# EAGLE design rf-bm-s02-breakout (EAGLE 6.5.0)
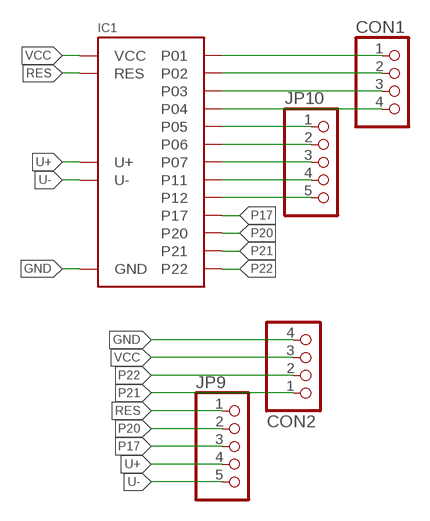
[diagram p0: schematic, sheet 1]

## Parts
CON1  GENERIC-1X4STRAIGHT  [PINHEADER-100MIL-1X4-NOSILK]
CON2  GENERIC-1X4STRAIGHT  [PINHEADER-100MIL-1X4-NOSILK]
IC1  BLUETOOTH-RF-BM-S02  [BLUETOOTH-RF-BM-S02-SMD]
JP9  PINHD-1X5  [1X05]
JP10  PINHD-1X5  [1X05]

## Nets
GND: CON2.4 IC1.P$18(GND)
P01: CON1.1 IC1.P$9(P01)
P02: CON1.2 IC1.P$8(P02)
P03: CON1.3 IC1.P$7(P03)
P04: CON1.4 IC1.P$6(P04)
P05: IC1.P$5(P05) JP10.1
P06: IC1.P$4(P06) JP10.2
P07: IC1.P$3(P07) JP10.3
P11: IC1.P$2(P11) JP10.4
P12: IC1.P$1(P12) JP10.5
P17: IC1.P$12(P17) JP9.3
P20: IC1.P$13(P20) JP9.2
P21: CON2.1 IC1.P$15(P21)
P22: CON2.2 IC1.P$16(P22)
RES: IC1.P$14(RES) JP9.1
U+: IC1.P$11(U+) JP9.4
U-: IC1.P$10(U-) JP9.5
VCC: CON2.3 IC1.P$17(VCC)

## Library data of the parts
CON1 CON2 = p.peter-connectors:GENERIC-1X4
IC1 = p.peter-periphery:BLUETOOTH-RF-BM-S02
JP9 JP10 = pinhead-mod:PINHD-1X5: PIN HEADER

## Board
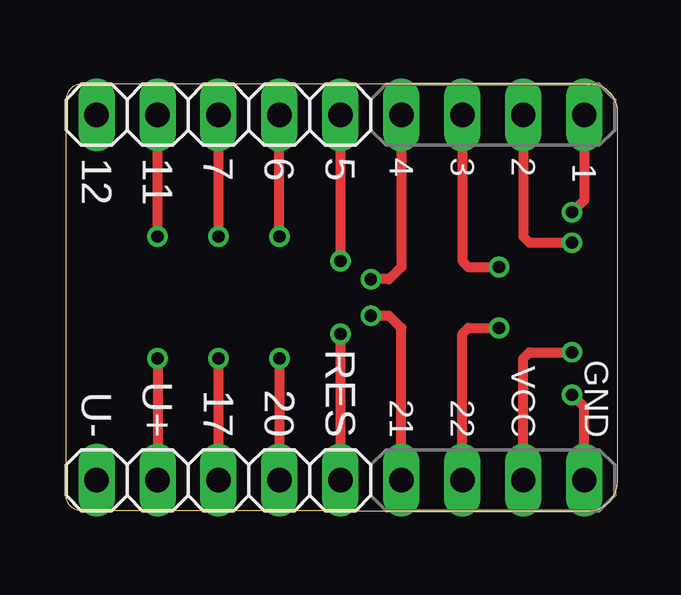
[diagram p1: board, top side]
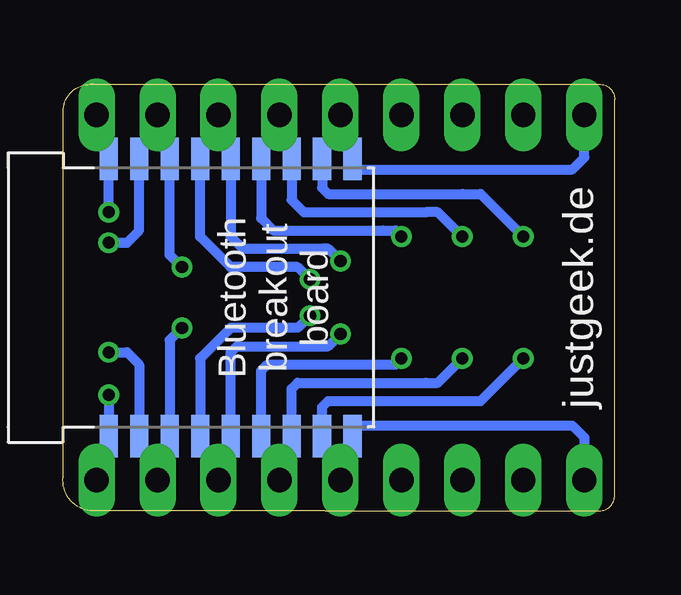
[diagram p2: board, bottom side, seen from below]

Size 22.99 x 17.78 mm. Coordinates in mm from the lower left corner, seen from the top.
Outline: 21.84,17.78 arc-90 22.99,16.64 22.99,1.4 arc-90 21.84,0 12.06,0 0.64,0 arc-90 0,0.64 0,17.14 arc-90 0.64,17.78 12.06,17.78 21.72,17.78
Outline: 21.84,17.78 21.72,17.78
Outline: 21.72,17.78 21.84,17.78
Outline: 21.84,17.78 21.72,17.78
Outline: 21.72,17.78 21.84,17.78
Outline: 21.84,17.78 21.72,17.78
Copper layers (1*16): Top 0.0356mm / dielectric 1.5011mm / Bottom 0.0356mm
Design rules "oshpark": minimum track width 6mil, minimum drill 13mil, track to track 6mil, track to pad 6mil, pad to pad 6mil, via to via 6mil, smd to smd 6mil, copper to edge 15mil, drill to drill 6mil, minimum pad ring 7mil, minimum via ring 7mil, stop-mask expansion 4mil, vias tented up to drill 4.1mm, thermal gap 10mil

### Footprints (pad centres in the part's own frame; a part is rotated, then mirrored left to right if it is on the bottom)
PINHEADER-100MIL-1X4-NOSILK = drill 1.016 long: 1 -3.81,0; 2 -1.27,0; 3 1.27,0; 4 3.81,0
BLUETOOTH-RF-BM-S02-SMD = smd 0.762 x 1.778: P$1 -5.08,-5.779; P$2 -3.81,-5.779; P$3 -2.54,-5.779; P$4 -1.27,-5.779; P$5 0,-5.779; P$6 1.27,-5.779; P$7 2.54,-5.779; P$8 3.81,-5.779; P$9 5.08,-5.779; P$10 -5.08,5.779; P$11 -3.81,5.779; P$12 -2.54,5.779; P$13 -1.27,5.779; P$14 0,5.779; P$15 1.27,5.779; P$16 2.54,5.779; P$17 3.81,5.779; P$18 5.08,5.779
1X05 = drill 1.016 long: 1 -5.08,0; 2 -2.54,0; 3 0,0; 4 2.54,0; 5 5.08,0

### Placement (x,y rotation side)
CON1  17.78,16.51 180 top
CON2  17.78,1.27 0 top
IC1  16,8.89 180 bottom
JP9  6.35,1.27 180 top
JP10  6.35,16.51 180 top

### Tracks (layer width: path | path; a pad name or v marks a point on that pad's centre or on a via)
GND  (via drill 0.51)
  Top 0.406: CON2.4 21.59,4.32 v21.08,4.83
  Bottom 0.406: v21.08,4.83 IC1.P$18
P01  (via drill 0.51)
  Top 0.406: CON1.1 21.59,12.95 v21.08,12.45
  Bottom 0.406: v21.08,12.45 IC1.P$9
P02  (via drill 0.51)
  Top 0.406: CON1.2 19.05,11.43 19.3,11.18 v21.08,11.18
  Bottom 0.406: v21.08,11.18 20.32,11.18 19.81,11.68 IC1.P$8
P03  (via drill 0.51)
  Top 0.406: CON1.3 16.51,10.41 16.76,10.16 v18.03,10.16
  Bottom 0.406: v18.03,10.16 18.54,10.67 IC1.P$7
P04  (via drill 0.51)
  Top 0.406: CON1.4 13.97,13.21 13.97,10.16 13.46,9.65 v12.7,9.65
  Bottom 0.406: v12.7,9.65 13.21,10.16 16,10.16 17.27,11.43 IC1.P$6
P05  (via drill 0.51)
  Top 0.406: JP10.1 v11.43,10.41
  Bottom 0.406: IC1.P$5 16,11.43 15.49,10.92 12.19,10.92 11.94,10.92 v11.43,10.41
P06  (via drill 0.51)
  Top 0.406: v8.89,11.43 JP10.2
  Bottom 0.406: IC1.P$4 14.73,12.19 14.22,11.68 9.65,11.68 9.14,11.68 v8.89,11.43
P07  (via drill 0.51)
  Top 0.406: JP10.3 v6.35,11.43
  Bottom 0.406: IC1.P$3 13.46,12.95 12.95,12.45 12.7,12.45 7.87,12.45 7.37,12.45 v6.35,11.43
P11  (via drill 0.51)
  Top 0.406: v3.81,11.43 JP10.4
  Bottom 0.406: IC1.P$2 12.19,13.97 12.19,13.46 11.94,13.21 6.35,13.21 5.59,13.21 v3.81,11.43
P12
  Bottom 0.406: IC1.P$1 10.92,14.22 1.78,14.22 1.27,14.73 JP10.5
P17  (via drill 0.51)
  Top 0.406: v6.35,6.35 JP9.3
  Bottom 0.406: IC1.P$12 13.46,5.08 13.21,5.33 7.87,5.33 7.37,5.33 v6.35,6.35
P20  (via drill 0.51)
  Top 0.406: v8.89,6.35 JP9.2
  Bottom 0.406: IC1.P$13 14.73,5.84 14.48,6.1 9.14,6.1 v8.89,6.35
P21  (via drill 0.51)
  Top 0.406: CON2.1 13.97,7.62 13.46,8.13 v12.7,8.13
  Bottom 0.406: v12.7,8.13 13.21,7.62 16,7.62 17.27,6.35 IC1.P$15
P22  (via drill 0.51)
  Top 0.406: CON2.2 16.51,7.37 16.76,7.62 v18.03,7.62
  Bottom 0.406: v18.03,7.62 18.54,7.11 IC1.P$16
RES  (via drill 0.51)
  Top 0.406: v11.43,7.37 JP9.1
  Bottom 0.406: IC1.P$14 16,6.6 15.75,6.86 11.94,6.86 v11.43,7.37
U+  (via drill 0.51)
  Top 0.406: v3.81,6.35 JP9.4
  Bottom 0.406: IC1.P$11 12.19,4.32 11.94,4.57 5.59,4.57 v3.81,6.35
U-
  Bottom 0.406: IC1.P$10 10.92,3.56 1.78,3.56 1.27,3.05 JP9.5
VCC  (via drill 0.51)
  Top 0.406: CON2.3 19.05,5.08 19.05,6.35 19.3,6.6 v21.08,6.6
  Bottom 0.406: v21.08,6.6 20.32,6.6 19.81,6.1 IC1.P$17

### Text on the board
tPlace: 12 | 11 | 7 | 6 | 5 | 4 | 3 | 2 | 1 | U- | U+ | 17 | 20 | RES | 21 | 22 | VCC | GND
bPlace: justgeek.de | Bluetooth / breakout / board